# Altium schematic sheet astabilny generator sygnalu.SchDoc
size A4
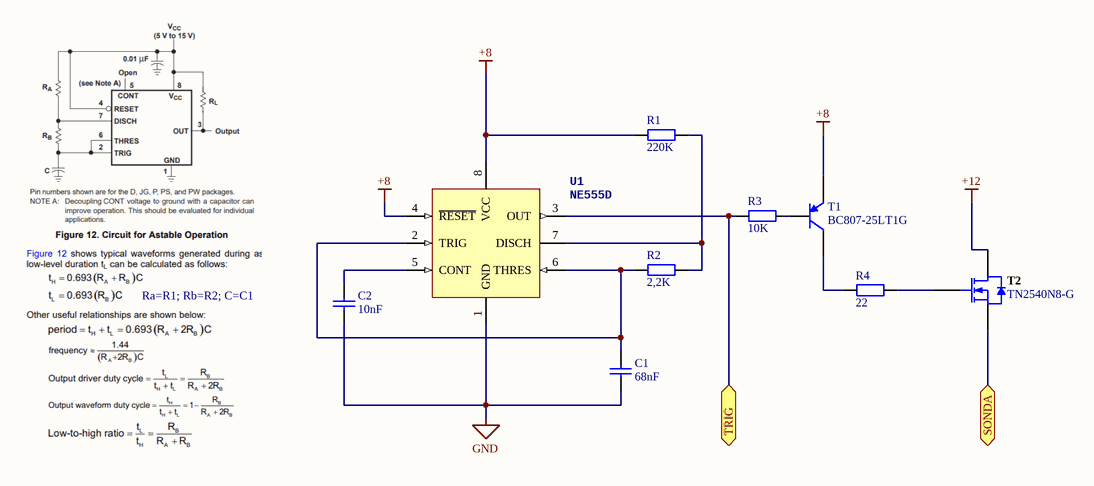
[diagram p0: astabilny generator sygnalu.SchDoc]

## Parts
C1  Capacitance: 68nF  [0603]  (hidden comment: C0603C683K5RACTU@TME)
C2  Capacitance: 10nF  [0603]  (hidden comment: CL10B103KB8NNNC@TME)
R1  value 220K  [R1206]  (hidden comment: 1206S4J0224T5E@TME)
R2  value 2,2K  [R1206]  (hidden comment: 1206S4J0222T5E@TME)
R3  value 10K  [R1206]  (hidden comment: 1206S4J0103T5E@TME)
R4  value 22  [R1206]  (hidden comment: 1206S4J0220T5E@TME)
T1  BC807-25LT1G  [ONSC-SOT-23-3-318-08_V]
T2  TN2540N8-G  [MCHP-TO-243AA_N8_L]
U1  NE555D  [D0008A_L]

## Ports
SONDA (bidir), TRIG (bidir)

## Nets
+8: R1.1 T1.2(E) U1.4(~{RESET}) U1.8(VCC)
+12: T2.2(D)
GND: C1.2 C2.2 U1.1(GND)
SONDA: T2.3(S) ; port SONDA
TRIG: R3.1 U1.3(OUT) ; port TRIG
NetC1_1: C1.1 R2.1 U1.2(TRIG) U1.6(THRES)
NetC2_1: C2.1 U1.5(CONT)
NetR1_2: R1.2 R2.2 U1.7(DISCH)
NetR3_2: R3.2 T1.1(B)
NetR4_1: R4.1 T1.3(C)
NetR4_2: R4.2 T2.1(G)

## Notes on the sheet
- Ra=R1; Rb=R2; C=C1

## Library data of the parts
C1 C2 = Cap: Capacitor
R1-R4 = Res: Resistor
T1 = CMP-1048-00691-1: General Purpose Transistor, PNP Silicon, 3-Pin SOT-23, Pb-Free, Tape and Reel; Manufacturer: On Semiconductor; IC Continuous (A): -0.5; fT Min (MHz): 100; PackageDescription: 3-Pin Small Outline Transistor, Body 2.92 x 1.3 mm, Pitch 0.95 mm; Polarity: PNP; ComponentLink2URL: http://www.onsemi.com/pub_link/Collateral/BC807-16LT1-D.PDF; PackageReference: SOT-23-3-318-08; ComponentLink2Description: Datasheet; ComponentLink1Description: Manufacturer URL; PartNumber: BC807-25LT1G; ComponentLink3URL: http://www.onsemi.cn/pub_link/Collateral/318-08.PDF; Packing: Tape and Reel; DatasheetVersion: Rev. 10; RoHS: TRUE; ComponentLink3Description: Package Specification; PackageVersion: Rev. AP, 11/2009; ComponentLink1URL: http://www.onsemi.com/; Mounting Technology: Surface Mount
T2 = CMP-2000-07270-1: N-Channel Enhancement-Mode Vertical DMOS FET, 2 V, 1 A, 12 Ohm, -55 to 150 degC, 3-Pin SOT-89, RoHS, Tape and Reel; Manufacturer: Microchip; Transistor Type: 1N-Channel; Number of Channels: 1Channel; Typical Turn-Off Delay Time: 25ns; Configuration: Single; Rise Time: 15ns; Vds - Drain-Source Breakdown Voltage: 400V; Brand: MicrochipTechnology; Typical Turn-On Delay Time: 20ns; Vgs - Gate-Source Voltage: 20V; Pd - Power Dissipation: 1.6W; Id - Continuous Drain Current: 260mA; Unit Weight: 0.001862oz; Rds On - Drain-Source Resistance: 12Ohms; Product Category: MOSFET; Package Description: 3-Piin Small Outline Transistor, Body 4.5 x 2.445 mm, Pitch 1.5 mm; Package Reference: TO-243AA; Length: 4.6mm; Manufacturer URL: http://www.microchip.com/; Type: FET; Packaging: Reel; Minimum Operating Temperature: -55C; Transistor Polarity: N-Channel; Technology: Si; Mounting Style: SMD/SMT; RoHS: True; Mounting Technology: SurfaceMount; Height: 1.6mm; Maximum Operating Temperature: +150C; Fall Time: 15ns; Package / Case: SOT-89-3; Product: MOSFETSmallSignal; Datasheet URL: http://ww1.microchip.com/downloads/en/DeviceDoc/TN2540%20A062113.pdf; Factory Pack Quantity: 2000; Datasheet Version: 08/2013; Width: 2.6mm; Channel Mode: Enhancement
U1 = NE555: Precision Timer, 4.5 to 16 V, 0 to 70 degC, 8-Pin SOIC (D), Green (RoHS & no Sb/Br), Tube; Manufacturer: Texas Instruments; Base Number: 555; No. of Timers: 1; Supply Voltage Min: 4.5V; Operating Frequency Max: 0.5MHz; Supply Voltage Range: 4.5Vto16V; No. of Pins: 8; Supply Voltage Max: 16V; IC Temperature Range: Commercial; SVHC: NoSVHC(19-Dec-2012); Operating Mode: Astable,Monostable; Frequency: 500kHz; Package Description: 8-Pin Small Outline Integrated Circuit, Body 4.9 x 3.9 mm, Pitch 1.27 mm; Datasheet URL: http://www.ti.com/general/docs/lit/getliterature.tsp?genericPartNumber=NE555&fileType=pdf; Mounting Technology: SurfaceMount; Operating Temperature Range: 0°Cto+70°C; Operating Temperature Min: 0°C; Package URL: http://www.ti.com/lit/ml/msoi002j/msoi002j.pdf; Datasheet Version: Rev. I, 09/2014; Manufacturer URL: http://www.ti.com/; Digital IC Case Style: SOIC; PartNumber: NE555; Clock External Input: No; Logic Function Number: 555; IC Generic Number: 555; No. of Channels: 1; Operating Temperature Max: 70°C; Package / Case: SOIC; Package Reference: D8; Device Marking: NE555D